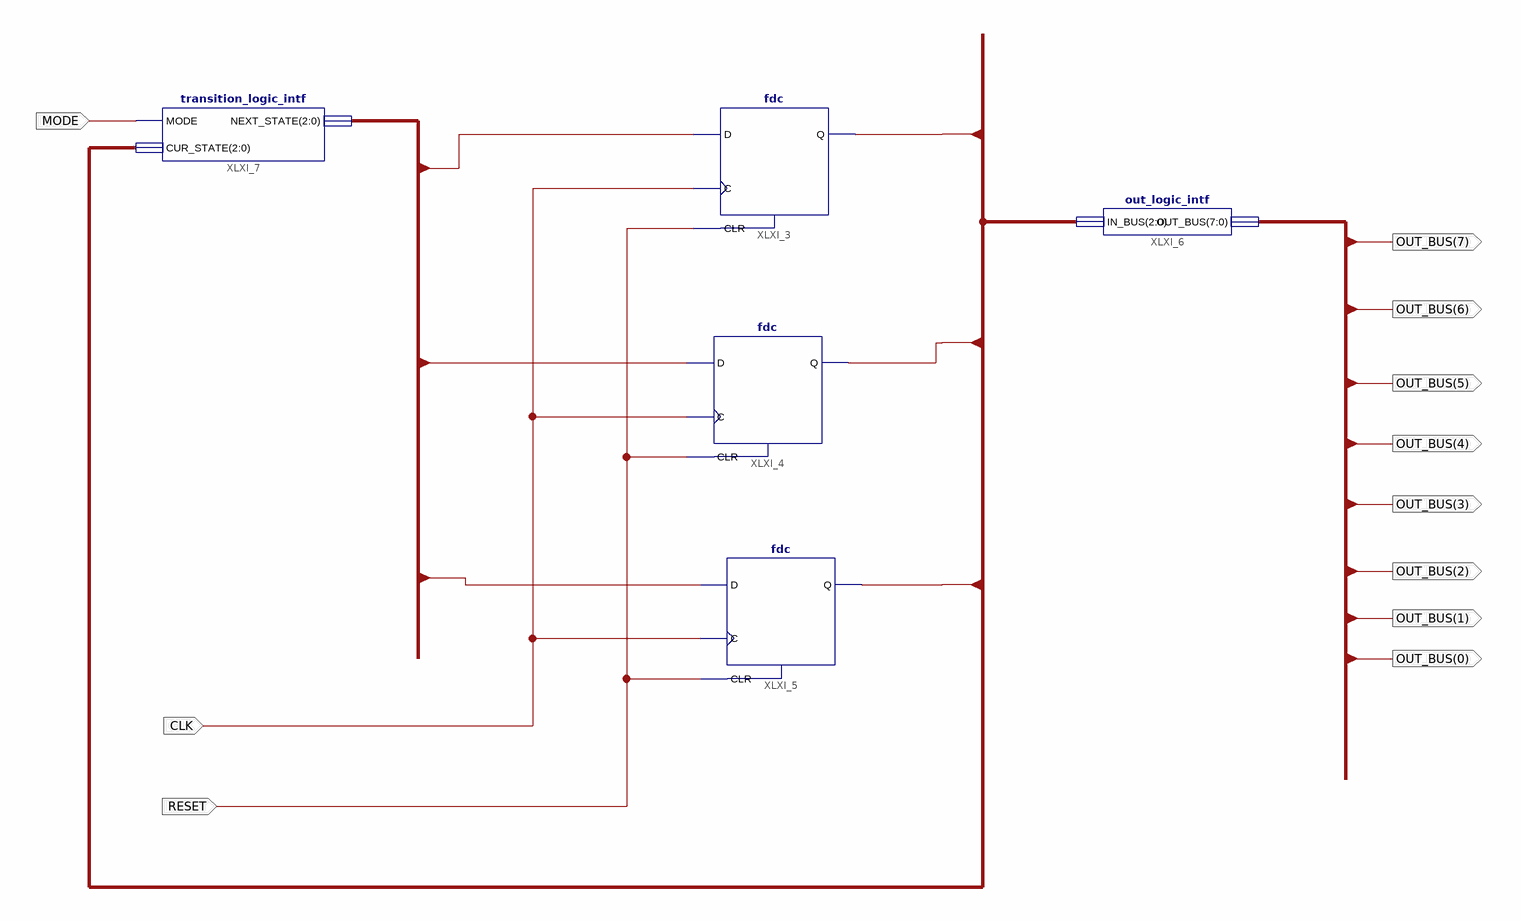
[diagram p0: schematic sheet 1]
// Xilinx ISE schematic LightController.sch (spartan3a) as structural Verilog: 5 symbols, 11 ports
module LightController (
  input  RESET,
  input  CLK,
  input  MODE,
  output [7:0] OUT_BUS
);

  wire [2:0] CUR_S_BUS, NEXT_S;

  fdc XLXI_3 (.C(CLK), .CLR(RESET), .D(NEXT_S[0]), .Q(CUR_S_BUS[0]));
  fdc XLXI_4 (.C(CLK), .CLR(RESET), .D(NEXT_S[1]), .Q(CUR_S_BUS[1]));
  fdc XLXI_5 (.C(CLK), .CLR(RESET), .D(NEXT_S[2]), .Q(CUR_S_BUS[2]));
  out_logic_intf XLXI_6 (.IN_BUS(CUR_S_BUS), .OUT_BUS(OUT_BUS));
  transition_logic_intf XLXI_7 (.MODE(MODE), .CUR_STATE(CUR_S_BUS), .NEXT_STATE(NEXT_S));
endmodule
